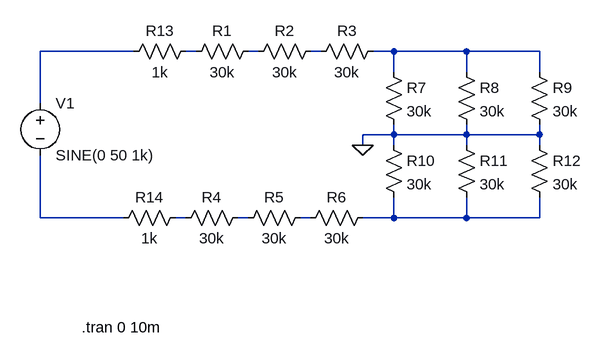
[diagram p0: schematic Diff_Probe_V1_Input.asc]
Diff_Probe_V1_Input.asc, the LTspice schematic file:
Version 4
SHEET 1 880 728
WIRE 160 288 16 288
WIRE 256 288 240 288
WIRE 352 288 336 288
WIRE 448 288 432 288
WIRE 560 288 528 288
WIRE 672 288 560 288
WIRE 784 288 672 288
WIRE 560 320 560 288
WIRE 672 320 672 288
WIRE 784 320 784 288
WIRE 16 368 16 288
WIRE 560 416 560 400
WIRE 560 416 512 416
WIRE 672 416 672 400
WIRE 672 416 560 416
WIRE 784 416 784 400
WIRE 784 416 672 416
WIRE 512 432 512 416
WIRE 560 432 560 416
WIRE 672 432 672 416
WIRE 784 432 784 416
WIRE 16 544 16 448
WIRE 144 544 16 544
WIRE 240 544 224 544
WIRE 336 544 320 544
WIRE 432 544 416 544
WIRE 560 544 560 512
WIRE 560 544 512 544
WIRE 672 544 672 512
WIRE 672 544 560 544
WIRE 784 544 784 512
WIRE 784 544 672 544
FLAG 512 432 0
SYMBOL Res 352 272 R90
WINDOW 0 0 56 VBottom 2
WINDOW 3 32 56 VTop 2
SYMATTR InstName R1
SYMATTR Value 30k
SYMBOL Res 448 272 R90
WINDOW 0 0 56 VBottom 2
WINDOW 3 32 56 VTop 2
SYMATTR InstName R2
SYMATTR Value 30k
SYMBOL Res 544 272 R90
WINDOW 0 0 56 VBottom 2
WINDOW 3 32 56 VTop 2
SYMATTR InstName R3
SYMATTR Value 30k
SYMBOL Res 336 528 R90
WINDOW 0 0 56 VBottom 2
WINDOW 3 32 56 VTop 2
SYMATTR InstName R4
SYMATTR Value 30k
SYMBOL Res 432 528 R90
WINDOW 0 0 56 VBottom 2
WINDOW 3 32 56 VTop 2
SYMATTR InstName R5
SYMATTR Value 30k
SYMBOL Res 528 528 R90
WINDOW 0 0 56 VBottom 2
WINDOW 3 32 56 VTop 2
SYMATTR InstName R6
SYMATTR Value 30k
SYMBOL Res 544 304 R0
SYMATTR InstName R7
SYMATTR Value 30k
SYMBOL Res 656 304 R0
SYMATTR InstName R8
SYMATTR Value 30k
SYMBOL Res 768 304 R0
SYMATTR InstName R9
SYMATTR Value 30k
SYMBOL Res 544 416 R0
SYMATTR InstName R10
SYMATTR Value 30k
SYMBOL Res 656 416 R0
SYMATTR InstName R11
SYMATTR Value 30k
SYMBOL Res 768 416 R0
SYMATTR InstName R12
SYMATTR Value 30k
SYMBOL Res 256 272 R90
WINDOW 0 0 56 VBottom 2
WINDOW 3 32 56 VTop 2
SYMATTR InstName R13
SYMATTR Value 1k
SYMBOL Res 240 528 R90
WINDOW 0 0 56 VBottom 2
WINDOW 3 32 56 VTop 2
SYMATTR InstName R14
SYMATTR Value 1k
SYMBOL Voltage 16 352 R0
SYMATTR InstName V1
SYMATTR Value SINE(0 50 1k)
TEXT 80 712 Left 2 !.tran 0 10m

The netlist it stands for:
* Diff_Probe_V1_Input.asc
R1 N003 N002 30k
R2 N004 N003 30k
R3 N005 N004 30k
R4 N008 N007 30k
R5 N009 N008 30k
R6 N010 N009 30k
R7 N005 0 30k
R8 N005 0 30k
R9 N005 0 30k
R10 0 N010 30k
R11 0 N010 30k
R12 0 N010 30k
R13 N002 N001 1k
R14 N007 N006 1k
V1 N001 N006 SINE(0 50 1k)
.tran 0 10m
.backanno
.end